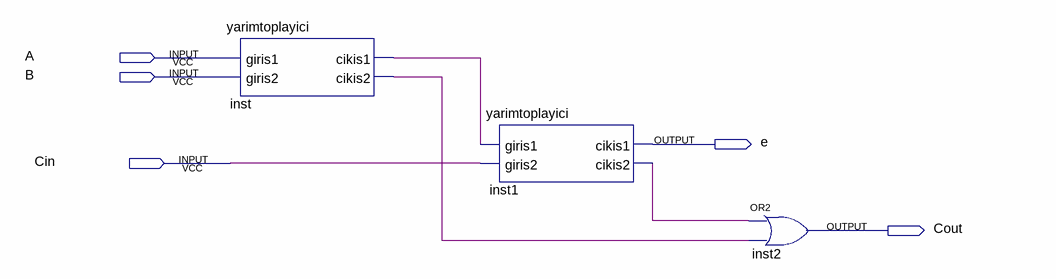
[diagram p0: schematic sheet]
// Quartus schematic tamtoplayici.bdf as structural Verilog: 3 symbols, 5 pins
module tamtoplayici (
  input  A,
  input  B,
  input  Cin,
  output e,
  output Cout
);

  wire inst1_cikis2, inst_cikis1, inst_cikis2;

  yarimtoplayici inst (.giris1(A), .giris2(B), .cikis1(inst_cikis1), .cikis2(inst_cikis2));
  yarimtoplayici inst1 (.giris1(inst_cikis1), .giris2(Cin), .cikis1(e), .cikis2(inst1_cikis2));
  or inst2 (Cout, inst1_cikis2, inst_cikis2);
endmodule
